# EAGLE schematic h-bridge mosfets ver 4 (EAGLE 7.7.0)
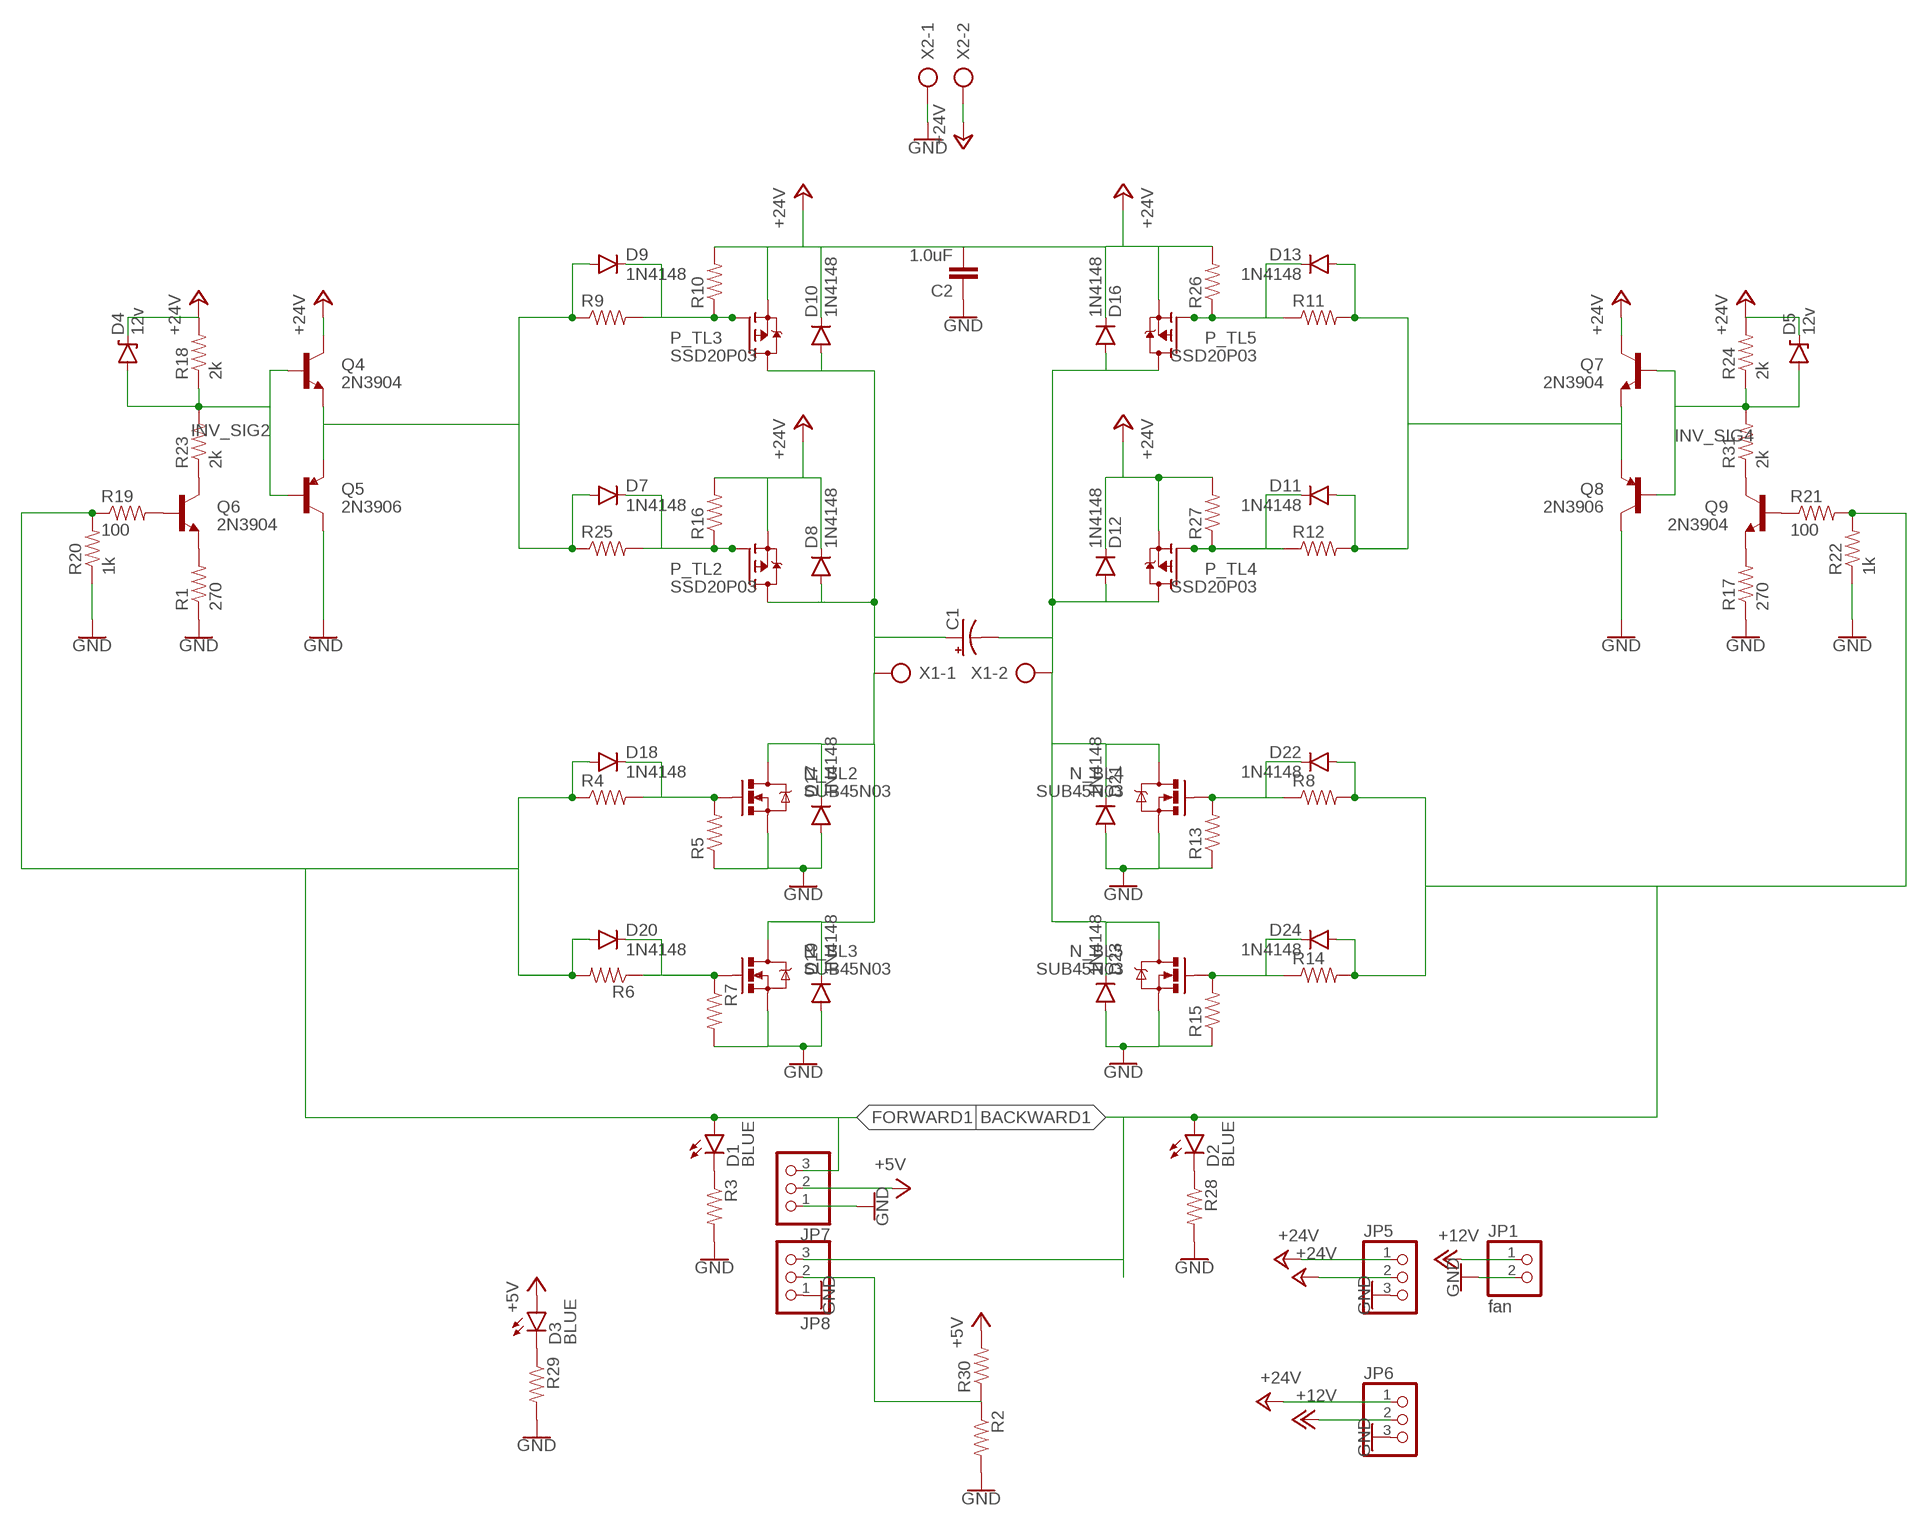
[diagram p0: schematic, sheet 1]

## Parts
C1  1000UF-25V(PTH)  [CPOL-RADIAL-1000UF-25V]
C2  1.0uF  1.0UF50V10%(1206)  [1206]
D1  BLUE  LED-BLUE1206  [LED-1206]
D2  BLUE  LED-BLUE1206  [LED-1206]
D3  BLUE  LED-BLUE1206  [LED-1206]
D4  12v  DIODE-ZENERSMB  [SMB-DIODE]
D5  12v  DIODE-ZENERSMB  [SMB-DIODE]
D7  1N4148  DIODESOD123  [SOD-123]
D8  1N4148  DIODESOD123  [SOD-123]
D9  1N4148  DIODESOD123  [SOD-123]
D10  1N4148  DIODESOD123  [SOD-123]
D11  1N4148  DIODESOD123  [SOD-123]
D12  1N4148  DIODESOD123  [SOD-123]
D13  1N4148  DIODESOD123  [SOD-123]
D16  1N4148  DIODESOD123  [SOD-123]
D17  1N4148  DIODESOD123  [SOD-123]
D18  1N4148  DIODESOD123  [SOD-123]
D19  1N4148  DIODESOD123  [SOD-123]
D20  1N4148  DIODESOD123  [SOD-123]
D21  1N4148  DIODESOD123  [SOD-123]
D22  1N4148  DIODESOD123  [SOD-123]
D23  1N4148  DIODESOD123  [SOD-123]
D24  1N4148  DIODESOD123  [SOD-123]
JP1  fan  PINHD-1X2  [1X02]
JP5  PINHD-1X3  [1X03]
JP6  PINHD-1X3  [1X03]
JP7  PINHD-1X3  [1X03]
JP8  PINHD-1X3  [1X03]
N_BL2  SUB45N03  MOSFET-NCHANNELPSMN7R0  [TO-263/D2PAK]
N_BL3  SUB45N03  MOSFET-NCHANNELPSMN7R0  [TO-263/D2PAK]
N_BL4  SUB45N03  MOSFET-NCHANNELPSMN7R0  [TO-263/D2PAK]
N_BL5  SUB45N03  MOSFET-NCHANNELPSMN7R0  [TO-263/D2PAK]
P_TL2  SSD20P03  FDD4141TO252  [TO252]
P_TL3  SSD20P03  FDD4141TO252  [TO252]
P_TL4  SSD20P03  FDD4141TO252  [TO252]
P_TL5  SSD20P03  FDD4141TO252  [TO252]
Q4  2N3904  TRANSISTOR_NPNMMBT5088  [SOT23-3]
Q5  2N3906  TRANSISTOR_PNPPMBT3906  [SOT23-3]
Q6  2N3904  TRANSISTOR_NPNMMBT5088  [SOT23-3]
Q7  2N3904  TRANSISTOR_NPNMMBT5088  [SOT23-3]
Q8  2N3906  TRANSISTOR_PNPPMBT3906  [SOT23-3]
Q9  2N3904  TRANSISTOR_NPNMMBT5088  [SOT23-3]
R1  270  0.3OHM-1/8W-1%(0805)  [0805]
R2  0.3OHM-1/8W-1%(0805)  [0805]
R3  0.3OHM-1/8W-1%(0805)  [0805]
R4  0.3OHM-1/8W-1%(0805)  [0805]
R5  0.3OHM-1/8W-1%(0805)  [0805]
R6  0.3OHM-1/8W-1%(0805)  [0805]
R7  0.3OHM-1/8W-1%(0805)  [0805]
R8  0.3OHM-1/8W-1%(0805)  [0805]
R9  0.3OHM-1/8W-1%(0805)  [0805]
R10  0.3OHM-1/8W-1%(0805)  [0805]
R11  0.3OHM-1/8W-1%(0805)  [0805]
R12  0.3OHM-1/8W-1%(0805)  [0805]
R13  0.3OHM-1/8W-1%(0805)  [0805]
R14  0.3OHM-1/8W-1%(0805)  [0805]
R15  0.3OHM-1/8W-1%(0805)  [0805]
R16  0.3OHM-1/8W-1%(0805)  [0805]
R17  270  0.3OHM-1/8W-1%(0805)  [0805]
R18  2k  0.3OHM-1/8W-1%(0805)  [0805]
R19  100  0.3OHM-1/8W-1%(0805)  [0805]
R20  1k  0.3OHM-1/8W-1%(0805)  [0805]
R21  100  0.3OHM-1/8W-1%(0805)  [0805]
R22  1k  0.3OHM-1/8W-1%(0805)  [0805]
R23  2k  0.3OHM-1/8W-1%(0805)  [0805]
R24  2k  0.3OHM-1/8W-1%(0805)  [0805]
R25  0.3OHM-1/8W-1%(0805)  [0805]
R26  0.3OHM-1/8W-1%(0805)  [0805]
R27  0.3OHM-1/8W-1%(0805)  [0805]
R28  0.3OHM-1/8W-1%(0805)  [0805]
R29  0.3OHM-1/8W-1%(0805)  [0805]
R30  RESISTORPTH-1/4W-VERT-KIT  [AXIAL-0.1EZ]
R31  2k  0.3OHM-1/8W-1%(0805)  [0805]
X1  AK300/2  [AK300/2]
X2  AK300/2  [AK300/2]

## Nets
+5V: D3.A JP7.2 R30.P$2
+12V: JP1.1 JP6.2
+24V: C2.2 D4.C D5.C D8.C D10.C D12.C D16.C JP5.1 JP5.2 JP6.1 P_TL2.2(S) P_TL3.2(S) P_TL4.2(S) P_TL5.2(S) Q4.3(C) Q7.3(C) R10.2 R16.2 R18.2 R24.2 R26.2 R27.2 X2.2
BACKWARD1: D2.A D22.A D24.A JP8.3 R8.2 R14.2 R21.2 R22.2
DR2: D11.A D13.A Q7.2(E) Q8.2(E) R11.2 R12.2
FORWARD1: D1.A D18.A D20.A JP7.3 R4.1 R6.2 R19.1 R20.2
GND: C2.1 D17.A D19.A D21.A D23.A JP1.2 JP5.3 JP6.3 JP7.1 JP8.1 N_BL2.3(S) N_BL3.3(S) N_BL4.3(S) N_BL5.3(S) Q5.3(C) Q8.3(C) R1.1 R2.2 R3.2 R5.1 R7.2 R13.1 R15.1 R17.1 R20.1 R22.1 R28.2 R29.2 X2.1
INV_SIG2: D4.A Q4.1(B) Q5.1(B) R18.1 R23.2
INV_SIG4: D5.A Q7.1(B) Q8.1(B) R24.1 R31.2
LEFT: C1.- D12.A D16.A D21.C D23.C N_BL4.2(D) N_BL5.2(D) P_TL4.3(D) P_TL5.3(D) X1.2
N$1: Q6.2(E) R1.2
N$2: Q6.1(B) R19.2
N$3: Q9.1(B) R21.1
N$4: Q9.2(E) R17.2
N$5: D1.C R3.1
N$6: D2.C R28.1
N$7: D3.C R29.1
N$8: D7.C P_TL2.1(G) R16.1 R25.2
N$9: D20.C N_BL3.1(G) R6.1 R7.1
N$10: JP8.2 R2.1 R30.P$1
N$11: D9.C P_TL3.1(G) R9.2 R10.1
N$12: D22.C N_BL4.1(G) R8.1 R13.2
N$13: Q6.3(C) R23.1
N$14: D11.C P_TL4.1(G) R12.1 R27.1
N$15: Q9.3(C) R31.1
N$16: D13.C P_TL5.1(G) R11.1 R26.1
N$17: D7.A D9.A Q4.2(E) Q5.2(E) R9.1 R25.1
N$19: D18.C N_BL2.1(G) R4.2 R5.2
N$21: D24.C N_BL5.1(G) R14.1 R15.2
RIGHT: C1.+ D8.A D10.A D17.C D19.C N_BL2.2(D) N_BL3.2(D) P_TL2.3(D) P_TL3.3(D) X1.1

## Library data of the parts
C1 = SparkFun-Capacitors:1000UF-25V(PTH): CAP-08070; PROD_ID: CAP-09538; VALUE: CAP-09538
C2 = SparkFun-Capacitors:1.0UF50V10%(1206): CAP-09822; PROD_ID: CAP-09822
D1-D3 = SparkFun-LED:LED-BLUE: Blue LEDs for production use Various blue LEDs stocked by SparkFun production 0603 - DIO-08575 Rebel - DIO-09553 1206 - DIO-09911; PROD_ID: DIO-09911
D4 D5 = SparkFun-DiscreteSemi:DIODE-ZENER: Zener Diode Production Part - 8199 3.4V Zener Voltage
D7-D13 D16-D24 = SparkFun-DiscreteSemi:DIODE: Diode These are standard reverse protection diodes and small signal diodes. SMA package can handle up to about 1A. SOD-323 can handle about 200mA. What the SOD-323 package when ordering, there are some mfgs out there that are 5-pin packages.
JP1 = pinhead2:PINHD-1X2: PIN HEADER
JP5-JP8 = pinhead:PINHD-1X3: PIN HEADER
N_BL2-N_BL5 = SparkFun-DiscreteSemi:MOSFET-NCHANNEL: Common NMOSFET Parts MFG P/N Store ID Prod ID FDD8780 TRANS-09984 SI7820DN TRANS-11055 FDS6630A IC-08089 2N7002PW TRANS-11151 FQP30N06L COM-10213 TRANS-10060 BSS123LT1G TRANS-08345 BSS138 TRANS-00830 BS170 2N7000; PROD_ID: TRANS-12437; VALUE: 100A/100V
P_TL2-P_TL5 = transistor-fet:FDD4141: P-Channel PowerTrench® MOSFET Source: FDD4141.pdf
Q4 Q6 Q7 Q9 = SparkFun-DiscreteSemi:TRANSISTOR_NPN: Generic NPN BJT MMBT2222A - TRANS-08049 (SOT-23, 1A 40V) MPSA42 - TRANS-09116 (SOT-23, 500mA 300V) MMBT5088LT1G - TRANS-11160 (SOT-23, 50 mA 30V) BC547 - COM-08928 <http://www.sparkfun.com/products/8928> (TO-92 45V 100mA) (1.Collector 2.Base 3.Emitter) 2N3904 - COM-00521 <http://www.sparkfun.com/products/521> (TO-92 40V 200mA) (1.Emitter 2.Base 3.Collector) P2N2222A - COM-12852 <http://www.sparkfun.com/products/12852> (TO-92 40V 600mA) (1.Collector 2.Base 3.Emitter); PROD_ID: TRANS-11160; VALUE: MMBT5088
Q5 Q8 = SparkFun-DiscreteSemi:TRANSISTOR_PNP: Generic PNP BJT Double check pinouts against datasheets- not all devices are the same! MMBT3906 - 40V 200mA SOT-23 (TRANS-08052) MMBT4403 - 40V 600mA SOT-23 (TRANS-09245); PROD_ID: TRANS-08052; VALUE: PMBT3906
R1-R29 R31 = SparkFun-Resistors:0.3OHM-1/8W-1%(0805): RES-11622; PROD_ID: RES-11622; VALUE: 0.3
R30 = SparkFun-Resistors:RESISTOR: Resistor Basic schematic elements and footprints for 0603, 1206, and PTH resistors.
X1 X2 = con-ptr500:AK300/2: CONNECTOR; OC_FARNELL: unknown; OC_NEWARK: unknown